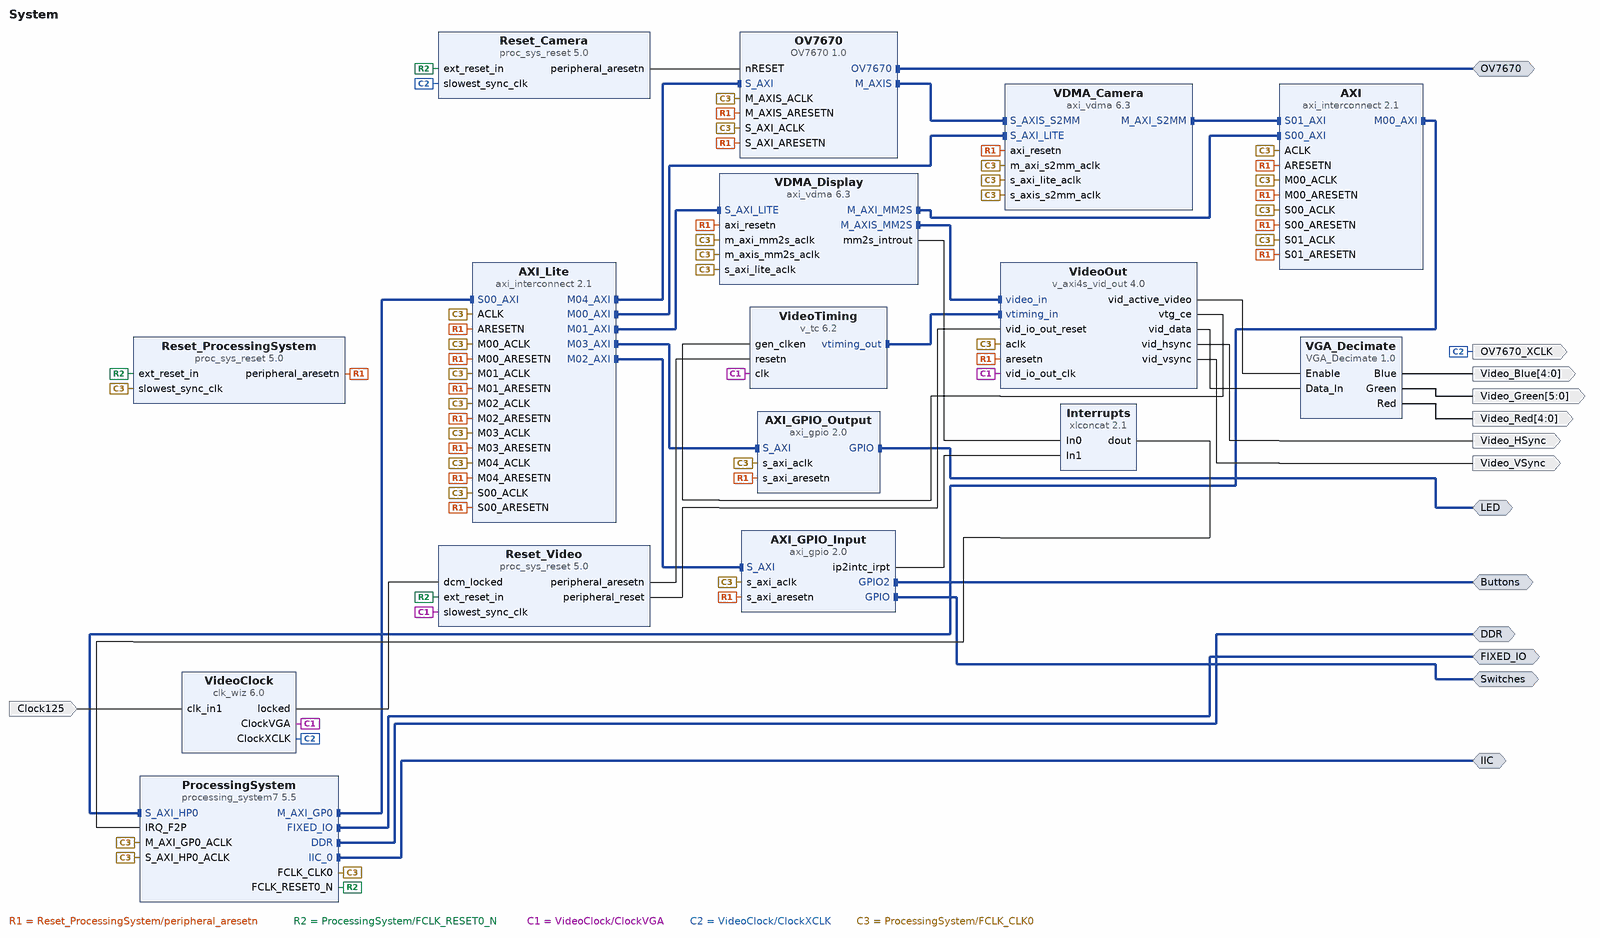
[diagram p0: block diagram of the top level]
# Vivado block design System, xc7z010clg400-1, Vivado 2020.2
create_bd_design System

create_bd_intf_port -mode Master -vlnv xilinx.com:interface:ddrx_rtl:1.0 DDR
create_bd_intf_port -mode Master -vlnv xilinx.com:display_processing_system7:fixedio_rtl:1.0 FIXED_IO
create_bd_intf_port -mode Master -vlnv xilinx.com:interface:iic_rtl:1.0 IIC
create_bd_intf_port -mode Master -vlnv xilinx.com:interface:gpio_rtl:1.0 Switches
create_bd_intf_port -mode Master -vlnv xilinx.com:interface:gpio_rtl:1.0 Buttons
create_bd_intf_port -mode Master -vlnv xilinx.com:interface:gpio_rtl:1.0 LED
create_bd_intf_port -mode Master -vlnv www.kampis-elektroecke.de:Kampis-Elektroecke:OV7670_rtl:1.0 OV7670
create_bd_port -dir I -type clk Clock125
set_property -dict {CONFIG.ASSOCIATED_RESET OV7670_NRESET CONFIG.FREQ_HZ 125000000} [get_bd_ports Clock125]
create_bd_port -dir O Video_HSync
create_bd_port -dir O Video_VSync
create_bd_port -dir O -from 4 -to 0 Video_Red
create_bd_port -dir O -from 4 -to 0 Video_Blue
create_bd_port -dir O -from 5 -to 0 Video_Green
create_bd_port -dir O -type clk OV7670_XCLK
set_property -dict {CONFIG.ASSOCIATED_RESET RESET CONFIG.FREQ_HZ 24013157} [get_bd_ports OV7670_XCLK]

create_bd_cell -type ip -vlnv xilinx.com:ip:proc_sys_reset:5.0 Reset_ProcessingSystem
create_bd_cell -type ip -vlnv xilinx.com:ip:processing_system7:5.5 ProcessingSystem
set_property -dict [list \
  CONFIG.PCW_APU_PERIPHERAL_FREQMHZ 650.000000 \
  CONFIG.PCW_CRYSTAL_PERIPHERAL_FREQMHZ 50.000000 \
  CONFIG.PCW_ENET0_PERIPHERAL_ENABLE 0 \
  CONFIG.PCW_FCLK1_PERIPHERAL_CLKSRC {DDR PLL} \
  CONFIG.PCW_FCLK2_PERIPHERAL_CLKSRC {ARM PLL} \
  CONFIG.PCW_FPGA0_PERIPHERAL_FREQMHZ 100.000000 \
  CONFIG.PCW_FPGA1_PERIPHERAL_FREQMHZ 175.000000 \
  CONFIG.PCW_FPGA2_PERIPHERAL_FREQMHZ 12.288000 \
  CONFIG.PCW_FPGA3_PERIPHERAL_FREQMHZ 100.000000 \
  CONFIG.PCW_GPIO_MIO_GPIO_ENABLE 0 \
  CONFIG.PCW_GPIO_PERIPHERAL_ENABLE 1 \
  CONFIG.PCW_I2C0_I2C0_IO EMIO \
  CONFIG.PCW_I2C0_PERIPHERAL_ENABLE 1 \
  CONFIG.PCW_I2C_PERIPHERAL_FREQMHZ 108.333336 \
  CONFIG.PCW_IMPORT_BOARD_PRESET G:/Dropbox/Git/ZYBO/res/Zybo.xml \
  CONFIG.PCW_IRQ_F2P_INTR 1 \
  CONFIG.PCW_PRESET_BANK1_VOLTAGE {LVCMOS 1.8V} \
  CONFIG.PCW_QSPI_PERIPHERAL_ENABLE 0 \
  CONFIG.PCW_SD0_GRP_CD_ENABLE 1 \
  CONFIG.PCW_SD0_GRP_CD_IO {MIO 47} \
  CONFIG.PCW_SD0_GRP_WP_ENABLE 1 \
  CONFIG.PCW_SD0_GRP_WP_IO EMIO \
  CONFIG.PCW_SD0_PERIPHERAL_ENABLE 1 \
  CONFIG.PCW_SD0_SD0_IO {MIO 40 .. 45} \
  CONFIG.PCW_SDIO_PERIPHERAL_FREQMHZ 50 \
  CONFIG.PCW_UART1_PERIPHERAL_ENABLE 1 \
  CONFIG.PCW_UART1_UART1_IO {MIO 48 .. 49} \
  CONFIG.PCW_UART_PERIPHERAL_FREQMHZ 50 \
  CONFIG.PCW_UIPARAM_DDR_FREQ_MHZ 525.000000 \
  CONFIG.PCW_UIPARAM_DDR_PARTNO {MT41K128M16 JT-125} \
  CONFIG.PCW_USB0_PERIPHERAL_ENABLE 0 \
  CONFIG.PCW_USE_FABRIC_INTERRUPT 1 \
  CONFIG.PCW_USE_S_AXI_HP0 1 \
] [get_bd_cells ProcessingSystem]
# 293 more settings of ProcessingSystem are not shown: defaults, MIO pin electricals, DDR timing, and values the tool derives
create_bd_cell -type ip -vlnv xilinx.com:ip:axi_vdma:6.3 VDMA_Display
set_property -dict [list \
  CONFIG.c_include_mm2s 1 \
  CONFIG.c_include_s2mm 0 \
  CONFIG.c_m_axi_mm2s_data_width 32 \
  CONFIG.c_m_axis_mm2s_tdata_width 24 \
  CONFIG.c_mm2s_genlock_mode 3 \
  CONFIG.c_mm2s_max_burst_length 16 \
  CONFIG.c_num_fstores 1 \
] [get_bd_cells VDMA_Display]
create_bd_cell -type ip -vlnv xilinx.com:ip:xlconcat:2.1 Interrupts
set_property -dict {CONFIG.NUM_PORTS 2} [get_bd_cells Interrupts]
create_bd_cell -type ip -vlnv xilinx.com:ip:clk_wiz:6.0 VideoClock
set_property -dict [list \
  CONFIG.CLKIN1_JITTER_PS 80.0 \
  CONFIG.CLKOUT1_JITTER 312.274 \
  CONFIG.CLKOUT1_PHASE_ERROR 245.713 \
  CONFIG.CLKOUT1_REQUESTED_OUT_FREQ 25.175 \
  CONFIG.CLKOUT2_JITTER 314.925 \
  CONFIG.CLKOUT2_PHASE_ERROR 245.713 \
  CONFIG.CLKOUT2_REQUESTED_OUT_FREQ 24.000 \
  CONFIG.CLKOUT2_USED true \
  CONFIG.CLK_OUT1_PORT ClockVGA \
  CONFIG.CLK_OUT2_PORT ClockXCLK \
  CONFIG.MMCM_CLKFBOUT_MULT_F 36.500 \
  CONFIG.MMCM_CLKIN1_PERIOD 8.000 \
  CONFIG.MMCM_CLKOUT0_DIVIDE_F 36.250 \
  CONFIG.MMCM_CLKOUT1_DIVIDE 38 \
  CONFIG.MMCM_DIVCLK_DIVIDE 5 \
  CONFIG.NUM_OUT_CLKS 2 \
  CONFIG.PRIM_IN_FREQ 125.000 \
  CONFIG.USE_RESET false \
] [get_bd_cells VideoClock]
create_bd_cell -type ip -vlnv xilinx.com:ip:proc_sys_reset:5.0 Reset_Video
create_bd_cell -type ip -vlnv xilinx.com:ip:v_tc:6.2 VideoTiming
set_property -dict {CONFIG.HAS_AXI4_LITE false CONFIG.VIDEO_MODE 480p CONFIG.enable_detection false} [get_bd_cells VideoTiming]
create_bd_cell -type ip -vlnv xilinx.com:ip:v_axi4s_vid_out:4.0 VideoOut
set_property -dict {CONFIG.C_HAS_ASYNC_CLK 1} [get_bd_cells VideoOut]
create_bd_cell -type ip -vlnv xilinx.com:ip:axi_vdma:6.3 VDMA_Camera
set_property -dict [list \
  CONFIG.c_enable_vert_flip 0 \
  CONFIG.c_include_mm2s 0 \
  CONFIG.c_include_s2mm 1 \
  CONFIG.c_num_fstores 1 \
  CONFIG.c_s2mm_genlock_mode 2 \
  CONFIG.c_s2mm_max_burst_length 8 \
] [get_bd_cells VDMA_Camera]
create_bd_cell -type ip -vlnv xilinx.com:ip:axi_interconnect:2.1 AXI_Lite
set_property -dict {CONFIG.NUM_MI 5} [get_bd_cells AXI_Lite]
create_bd_cell -type ip -vlnv xilinx.com:ip:axi_interconnect:2.1 AXI
set_property -dict {CONFIG.NUM_MI 1 CONFIG.NUM_SI 2} [get_bd_cells AXI]
create_bd_cell -type ip -vlnv xilinx.com:ip:axi_gpio:2.0 AXI_GPIO_Input
set_property -dict [list \
  CONFIG.C_ALL_INPUTS 1 \
  CONFIG.C_ALL_INPUTS_2 1 \
  CONFIG.C_GPIO2_WIDTH 4 \
  CONFIG.C_GPIO_WIDTH 4 \
  CONFIG.C_INTERRUPT_PRESENT 1 \
  CONFIG.C_IS_DUAL 1 \
] [get_bd_cells AXI_GPIO_Input]
create_bd_cell -type ip -vlnv xilinx.com:ip:proc_sys_reset:5.0 Reset_Camera
create_bd_cell -type ip -vlnv xilinx.com:ip:axi_gpio:2.0 AXI_GPIO_Output
set_property -dict [list \
  CONFIG.C_ALL_INPUTS 0 \
  CONFIG.C_ALL_OUTPUTS 1 \
  CONFIG.C_DOUT_DEFAULT 0x00000000 \
  CONFIG.C_GPIO_WIDTH 4 \
  CONFIG.C_INTERRUPT_PRESENT 0 \
  CONFIG.C_IS_DUAL 0 \
] [get_bd_cells AXI_GPIO_Output]
create_bd_cell -type ip -vlnv www.kampis-elektroecke.de:Kampis-Elektroecke:VGA_Decimate:1.0 VGA_Decimate
create_bd_cell -type ip -vlnv Kampis-Elektroecke:Kampis-Elektroecke:OV7670:1.0 OV7670

# ---- connections ----

connect_bd_intf_net -intf_net AXI_GPIO_GPIO2 [get_bd_intf_ports Buttons] [get_bd_intf_pins AXI_GPIO_Input/GPIO2]
connect_bd_intf_net -intf_net axi_mem_intercon_M00_AXI [get_bd_intf_pins AXI/M00_AXI] [get_bd_intf_pins ProcessingSystem/S_AXI_HP0]
connect_bd_intf_net -intf_net processing_system7_0_FIXED_IO [get_bd_intf_ports FIXED_IO] [get_bd_intf_pins ProcessingSystem/FIXED_IO]
connect_bd_intf_net [get_bd_intf_pins AXI_Lite/M02_AXI] [get_bd_intf_pins AXI_GPIO_Input/S_AXI]
connect_bd_intf_net [get_bd_intf_ports LED] [get_bd_intf_pins AXI_GPIO_Output/GPIO]
connect_bd_intf_net -intf_net OV7670_0_OV7670 [get_bd_intf_ports OV7670] [get_bd_intf_pins OV7670/OV7670]
connect_bd_intf_net [get_bd_intf_pins ProcessingSystem/M_AXI_GP0] [get_bd_intf_pins AXI_Lite/S00_AXI]
connect_bd_intf_net -intf_net processing_system7_0_DDR [get_bd_intf_ports DDR] [get_bd_intf_pins ProcessingSystem/DDR]
connect_bd_intf_net [get_bd_intf_pins VideoTiming/vtiming_out] [get_bd_intf_pins VideoOut/vtiming_in]
connect_bd_intf_net -intf_net OV7670_0_M_AXIS [get_bd_intf_pins VDMA_Camera/S_AXIS_S2MM] [get_bd_intf_pins OV7670/M_AXIS]
connect_bd_intf_net [get_bd_intf_pins AXI_Lite/M04_AXI] [get_bd_intf_pins OV7670/S_AXI]
connect_bd_intf_net -intf_net VDMA_M_AXIS_MM2S [get_bd_intf_pins VDMA_Display/M_AXIS_MM2S] [get_bd_intf_pins VideoOut/video_in]
connect_bd_intf_net [get_bd_intf_pins VDMA_Camera/M_AXI_S2MM] [get_bd_intf_pins AXI/S01_AXI]
connect_bd_intf_net -intf_net AXI_GPIO_GPIO [get_bd_intf_ports Switches] [get_bd_intf_pins AXI_GPIO_Input/GPIO]
connect_bd_intf_net [get_bd_intf_pins AXI_Lite/M03_AXI] [get_bd_intf_pins AXI_GPIO_Output/S_AXI]
connect_bd_intf_net [get_bd_intf_pins VDMA_Display/M_AXI_MM2S] [get_bd_intf_pins AXI/S00_AXI]
connect_bd_intf_net [get_bd_intf_ports IIC] [get_bd_intf_pins ProcessingSystem/IIC_0]
connect_bd_intf_net [get_bd_intf_pins AXI_Lite/M01_AXI] [get_bd_intf_pins VDMA_Display/S_AXI_LITE]
connect_bd_intf_net [get_bd_intf_pins AXI_Lite/M00_AXI] [get_bd_intf_pins VDMA_Camera/S_AXI_LITE]
connect_bd_net [get_bd_pins Interrupts/dout] [get_bd_pins ProcessingSystem/IRQ_F2P]
connect_bd_net -net clk_in1_0_1 [get_bd_ports Clock125] [get_bd_pins VideoClock/clk_in1]
connect_bd_net -net v_axi4s_vid_out_0_vid_hsync [get_bd_pins VideoOut/vid_hsync] [get_bd_ports Video_HSync]
connect_bd_net -net v_axi4s_vid_out_0_vid_vsync [get_bd_pins VideoOut/vid_vsync] [get_bd_ports Video_VSync]
connect_bd_net -net v_axi4s_vid_out_0_vid_active_video [get_bd_pins VideoOut/vid_active_video] [get_bd_pins VGA_Decimate/Enable]
connect_bd_net -net v_axi4s_vid_out_0_vid_data [get_bd_pins VideoOut/vid_data] [get_bd_pins VGA_Decimate/Data_In]
connect_bd_net [get_bd_pins VGA_Decimate/Red] [get_bd_ports Video_Red]
connect_bd_net [get_bd_pins VGA_Decimate/Blue] [get_bd_ports Video_Blue]
connect_bd_net [get_bd_pins VGA_Decimate/Green] [get_bd_ports Video_Green]
connect_bd_net [get_bd_pins Reset_Video/peripheral_reset] [get_bd_pins VideoOut/vid_io_out_reset]
connect_bd_net [get_bd_pins Reset_ProcessingSystem/peripheral_aresetn] \
  [get_bd_pins VDMA_Display/axi_resetn] [get_bd_pins VideoOut/aresetn] [get_bd_pins VDMA_Camera/axi_resetn] \
  [get_bd_pins AXI_Lite/S00_ARESETN] [get_bd_pins AXI_Lite/M00_ARESETN] [get_bd_pins AXI_Lite/ARESETN] \
  [get_bd_pins AXI_Lite/M01_ARESETN] [get_bd_pins AXI/S00_ARESETN] [get_bd_pins AXI/M00_ARESETN] [get_bd_pins AXI/ARESETN] \
  [get_bd_pins AXI/S01_ARESETN] [get_bd_pins AXI_GPIO_Input/s_axi_aresetn] [get_bd_pins AXI_Lite/M02_ARESETN] \
  [get_bd_pins AXI_GPIO_Output/s_axi_aresetn] [get_bd_pins AXI_Lite/M03_ARESETN] [get_bd_pins AXI_Lite/M04_ARESETN] \
  [get_bd_pins OV7670/S_AXI_ARESETN] [get_bd_pins OV7670/M_AXIS_ARESETN]
connect_bd_net [get_bd_pins VideoClock/locked] [get_bd_pins Reset_Video/dcm_locked]
connect_bd_net [get_bd_pins Reset_Video/peripheral_aresetn] [get_bd_pins VideoTiming/resetn]
connect_bd_net [get_bd_pins ProcessingSystem/FCLK_RESET0_N] \
  [get_bd_pins Reset_ProcessingSystem/ext_reset_in] [get_bd_pins Reset_Video/ext_reset_in] \
  [get_bd_pins Reset_Camera/ext_reset_in]
connect_bd_net [get_bd_pins VideoOut/vtg_ce] [get_bd_pins VideoTiming/gen_clken]
connect_bd_net [get_bd_pins VideoClock/ClockVGA] \
  [get_bd_pins VideoTiming/clk] [get_bd_pins Reset_Video/slowest_sync_clk] [get_bd_pins VideoOut/vid_io_out_clk]
connect_bd_net -net VDMA_mm2s_introut [get_bd_pins VDMA_Display/mm2s_introut] [get_bd_pins Interrupts/In0]
connect_bd_net [get_bd_pins VideoClock/ClockXCLK] [get_bd_ports OV7670_XCLK] [get_bd_pins Reset_Camera/slowest_sync_clk]
connect_bd_net [get_bd_pins ProcessingSystem/FCLK_CLK0] \
  [get_bd_pins ProcessingSystem/S_AXI_HP0_ACLK] [get_bd_pins VDMA_Camera/m_axi_s2mm_aclk] \
  [get_bd_pins VDMA_Display/m_axi_mm2s_aclk] [get_bd_pins VDMA_Display/s_axi_lite_aclk] \
  [get_bd_pins VDMA_Camera/s_axi_lite_aclk] [get_bd_pins ProcessingSystem/M_AXI_GP0_ACLK] \
  [get_bd_pins VDMA_Camera/s_axis_s2mm_aclk] [get_bd_pins Reset_ProcessingSystem/slowest_sync_clk] \
  [get_bd_pins VDMA_Display/m_axis_mm2s_aclk] [get_bd_pins VideoOut/aclk] [get_bd_pins AXI_Lite/ACLK] \
  [get_bd_pins AXI_Lite/S00_ACLK] [get_bd_pins AXI_Lite/M00_ACLK] [get_bd_pins AXI_Lite/M01_ACLK] [get_bd_pins AXI/ACLK] \
  [get_bd_pins AXI/S00_ACLK] [get_bd_pins AXI/M00_ACLK] [get_bd_pins AXI/S01_ACLK] [get_bd_pins AXI_GPIO_Input/s_axi_aclk] \
  [get_bd_pins AXI_Lite/M02_ACLK] [get_bd_pins AXI_GPIO_Output/s_axi_aclk] [get_bd_pins AXI_Lite/M03_ACLK] \
  [get_bd_pins AXI_Lite/M04_ACLK] [get_bd_pins OV7670/S_AXI_ACLK] [get_bd_pins OV7670/M_AXIS_ACLK]
connect_bd_net -net AXI_GPIO_ip2intc_irpt [get_bd_pins AXI_GPIO_Input/ip2intc_irpt] [get_bd_pins Interrupts/In1]
connect_bd_net [get_bd_pins Reset_Camera/peripheral_aresetn] [get_bd_pins OV7670/nRESET]

# ---- address map ----
assign_bd_address -offset 0x41200000 -range 64K -target_address_space [get_bd_addr_spaces ProcessingSystem/Data] [get_bd_addr_segs AXI_GPIO_Input/S_AXI/Reg]
assign_bd_address -offset 0x41210000 -range 64K -target_address_space [get_bd_addr_spaces ProcessingSystem/Data] [get_bd_addr_segs AXI_GPIO_Output/S_AXI/Reg]
assign_bd_address -offset 0x43000000 -range 64K -target_address_space [get_bd_addr_spaces ProcessingSystem/Data] [get_bd_addr_segs VDMA_Display/S_AXI_LITE/Reg]
assign_bd_address -offset 0x43010000 -range 64K -target_address_space [get_bd_addr_spaces ProcessingSystem/Data] [get_bd_addr_segs VDMA_Camera/S_AXI_LITE/Reg]
assign_bd_address -offset 0x43C00000 -range 64K -target_address_space [get_bd_addr_spaces ProcessingSystem/Data] [get_bd_addr_segs OV7670/S_AXI/Reg]
assign_bd_address -offset 0x00000000 -range 512M -target_address_space [get_bd_addr_spaces VDMA_Camera/Data_S2MM] [get_bd_addr_segs ProcessingSystem/S_AXI_HP0/HP0_DDR_LOWOCM]
assign_bd_address -offset 0x00000000 -range 512M -target_address_space [get_bd_addr_spaces VDMA_Display/Data_MM2S] [get_bd_addr_segs ProcessingSystem/S_AXI_HP0/HP0_DDR_LOWOCM]

validate_bd_design
save_bd_design
